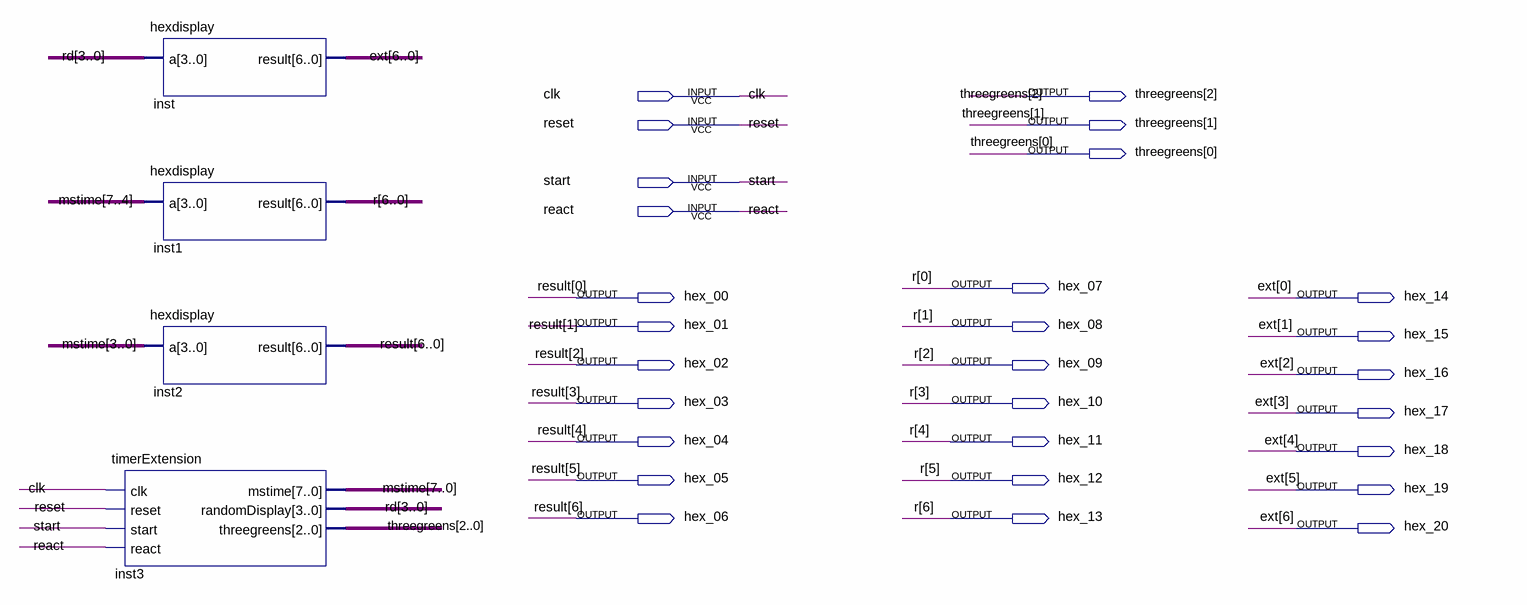
[diagram p0: schematic sheet]
// Quartus schematic reactionExtension.bdf as structural Verilog: 4 symbols, 28 pins
module reactionExtension (
  input  clk,
  input  reset,
  input  start,
  input  react,
  output [2:0] threegreens,
  output hex_07,
  output hex_00,
  output hex_14,
  output hex_01,
  output hex_08,
  output hex_15,
  output hex_02,
  output hex_09,
  output hex_16,
  output hex_03,
  output hex_10,
  output hex_17,
  output hex_04,
  output hex_11,
  output hex_18,
  output hex_05,
  output hex_12,
  output hex_19,
  output hex_06,
  output hex_13,
  output hex_20
);

  wire [3:0] rd;
  wire [7:0] mstime;

  hexdisplay inst (.a(rd), .result({hex_20, hex_19, hex_18, hex_17, hex_16, hex_15, hex_14}));
  hexdisplay inst1 (.a(mstime[7:4]), .result({hex_13, hex_12, hex_11, hex_10, hex_09, hex_08, hex_07}));
  hexdisplay inst2 (.a(mstime[3:0]), .result({hex_06, hex_05, hex_04, hex_03, hex_02, hex_01, hex_00}));
  timerExtension inst3 (
    .clk(clk), .reset(reset), .start(start), .react(react), .mstime(mstime), .randomDisplay(rd),
    .threegreens(threegreens));

  // Other names for the same wires on the sheet: ext[6:0] = {hex_20, hex_19, hex_18, hex_17, hex_16, hex_15, hex_14};
  //   r[6:0] = {hex_13, hex_12, hex_11, hex_10, hex_09, hex_08, hex_07};
  //   result[6:0] = {hex_06, hex_05, hex_04, hex_03, hex_02, hex_01, hex_00}
endmodule
